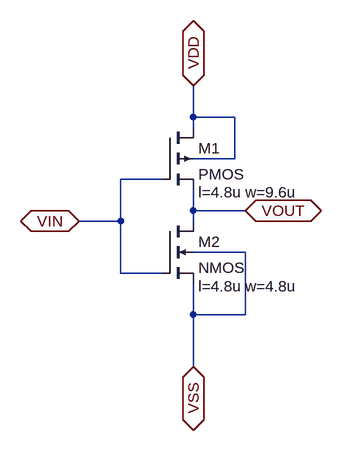
[diagram p0: schematic Inverter.asc]
Inverter.asc, the LTspice schematic file:
Version 4
SHEET 1 880 680
WIRE 240 0 240 -48
WIRE 304 0 240 0
WIRE 240 16 240 0
WIRE 304 64 304 0
WIRE 304 64 240 64
WIRE 192 96 128 96
WIRE 240 144 240 112
WIRE 320 144 240 144
WIRE 128 160 128 96
WIRE 128 160 64 160
WIRE 240 160 240 144
WIRE 320 208 240 208
WIRE 128 240 128 160
WIRE 192 240 128 240
WIRE 240 304 240 256
WIRE 320 304 320 208
WIRE 320 304 240 304
WIRE 240 384 240 304
FLAG 64 160 VIN
IOPIN 64 160 BiDir
FLAG 320 144 VOUT
IOPIN 320 144 BiDir
FLAG 240 -48 VDD
IOPIN 240 -48 BiDir
FLAG 240 384 VSS
IOPIN 240 384 BiDir
SYMBOL pmos4 192 16 R0
WINDOW 123 56 100 Left 2
SYMATTR Value2 l=4.8u w=9.6u
SYMATTR InstName M1
SYMBOL nmos4 192 160 R0
WINDOW 123 56 100 Left 2
SYMATTR Value2 l=4.8u w=4.8u
SYMATTR InstName M2

The netlist it stands for:
* Inverter.asc
M1 VDD VIN VOUT VDD PMOS l=4.8u w=9.6u
M2 VOUT VIN VSS VSS NMOS l=4.8u w=4.8u
.model NMOS NMOS
.model PMOS PMOS
.lib standard.mos
.backanno
.end